# Altium schematic sheet usb.SchDoc
size A
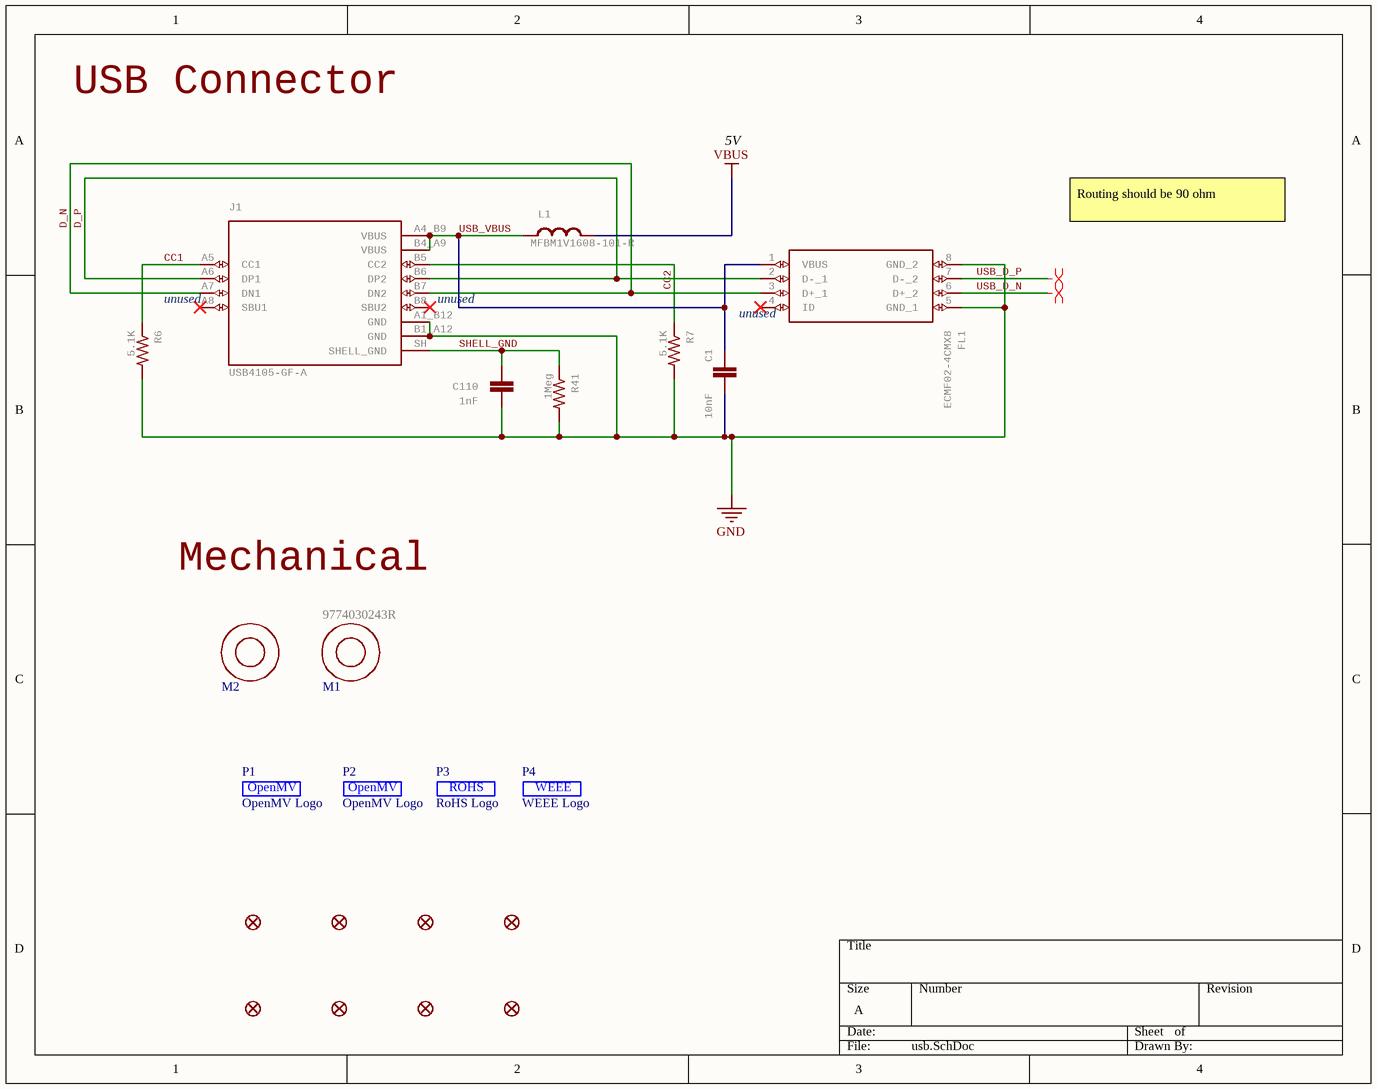
[diagram p0: usb.SchDoc]

## Parts
C1  10nF  [0402-CAP]
C110  1nF  [0402-CAP]
FD1  FIDUCIAL1X2  [FIDUCIAL-1X2]  (value not drawn)
FD2  FIDUCIAL1X2  [FIDUCIAL-1X2]  (value not drawn)
FD3  FIDUCIAL1X2  [FIDUCIAL-1X2]  (value not drawn)
FD4  FIDUCIAL1X2  [FIDUCIAL-1X2]  (value not drawn)
FD5  FIDUCIAL1X2  [FIDUCIAL-1X2]  (value not drawn)
FD6  FIDUCIAL1X2  [FIDUCIAL-1X2]  (value not drawn)
FD7  FIDUCIAL1X2  [FIDUCIAL-1X2]  (value not drawn)
FD8  FIDUCIAL1X2  [FIDUCIAL-1X2]  (value not drawn)
FL1  ECMF02-4CMX8  [ECMF024CMX8]
J1  USB4105-GF-A  [GCT_USB4105-GF-A]
L1  MFBM1V1608-101-R  [0603-RES]
M1  9774030243R  [9774030243R]
M2  9774030243R  [9774030243R]  (value not drawn)
P1  OpenMV Logo  [OMV-LOGO-SMALL]  (no BOM)
P2  OpenMV Logo  [OMV-LOGO-SMALL]  (no BOM)
P3  RoHS Logo  [ROHS]  (no BOM)
P4  WEEE Logo  [WEEE]  (no BOM)
R6  5.1K  [0402-RES]
R7  5.1K  [0402-RES]
R41  1Meg  [0402-RES]

## Nets
GND: C1.2 C110.2 FL1.5(GND_1) FL1.8(GND_2) J1.A1_B12(GND) J1.B1_A12(GND) R6.2 R7.2 R41.2
VBUS: L1.2
CC1: J1.A5(CC1) R6.1
CC2: J1.B5(CC2) R7.1
D_N: FL1.3(D+_1) J1.A7(DN1) J1.B7(DN2)
D_P: FL1.2(D-_1) J1.A6(DP1) J1.B6(DP2)
SHELL_GND: C110.1 J1.SH(SHELL_GND) R41.1
USB_D_N: FL1.6(D+_2)
USB_D_P: FL1.7(D-_2)
USB_VBUS: C1.1 FL1.1(VBUS) J1.A4_B9(VBUS) J1.B4_A9(VBUS) L1.1

Not connected (* = marked no-connect by the designer): FL1 4(ID)*; J1 A8(SBU1)* B8(SBU2)*

## Layout directives
differential pair: USB_D_N, USB_D_P

## Notes on the sheet
- USB Connector
- 5V
- Routing should be 90 ohm
- unused
- (near J1) unused
- (near FL1) unused
- Mechanical
- (in symbol OMV) OpenMV

## Library data of the parts
C1 = C-EUC0201: CAPACITOR, European symbol; MPN: 0402B103K250CT; GateName_1: G$1; SymbolName_1: C-EU; POPULARITY: 0; LibraryName: rcl; DeviceSetName: C-EU; SPICEPREFIX: C; Part Number: 0402B103K250CT
C110 = CAP0402-CAP: Capacitor; MPN: VJ0402Y102JXACW1BC; GateName_1: G$1; SymbolName_1: CAP; DeviceName: 0402-CAP; LibraryName: sfe; DeviceSetName: CAP; Part Number: VJ0402Y102JXACW1BC
FD1-FD8 = FIDUCIAL1X2: Fiducial Alignment Points    Point-of-reference for pick-and-place machines and other optical instruments.; GateName_1: G$1; DeviceName: 1X2; SymbolName_1: FIDUCIAL; LibraryName: SparkFun-Aesthetics; DeviceSetName: FIDUCIAL
FL1 = ECMF02-4CMX8: Common Mode Filter & ESD Prot. USB uQFN8 STMicroelectronics ECMF02 Series, Signal Filter uQFN SMD, Flat Contact Termination, 2.6 x 1.3 x 0.6mm   Source:  Datasheet; GateName_1: G$1; SymbolName_1: ECMF02-4CMX8; LibraryName: ECMF02-4CMX8; DeviceSetName: ECMF02-4CMX8; HEIGHT: mm; MANUFACTURER_NAME: STMicroelectronics; MANUFACTURER_PART_NUMBER: ECMF02-4CMX8; MOUSER_PART_NUMBER: 511-ECMF02-4CMX8; MOUSER_PRICE-STOCK: https://www.mouser.co.uk/ProductDetail/STMicroelectronics/ECMF02-4CMX8?qs=xYt8xtm2zhmK7GoDlDZR3A%3D%3D; MPN: ECMF02-4CMX8; Part Number: ECMF02-4CMX8
J1 = USB4105-GF-A: USB-C (USB TYPE-C) USB 2.0 Receptacle Connector 24 (16+8 Dummy) Position Surface Mount, Right Angle; Through Hole  Check availability; GateName_1: G$1; MF: GCT; SymbolName_1: USB4105-GF-A; LibraryName: USB4105-GF-A; DeviceSetName: USB4105-GF-A; AVAILABILITY: In Stock; MP: USB4105-GF-A; MPN: USB4105-GF-A; PACKAGE: None; PRICE: None; PURCHASE-URL: https://pricing.snapeda.com/search/part/USB4105-GF-A/?ref=eda; Part Number: USB4105-GF-A
L1 = INDUCTOR: InductorsBasic Inductor/Choke - 0603 and 1206. Footprints are not proven and vary greatly between part numbers.; GateName_1: G$1; MPN: MFBM1V1608-101-R; Part Number: MFBM1V1608-101-R
M1 M2 = 9774030243R: M2 3mm Standoff; GateName_1: G$1; SymbolName_1: 9774030243R; LibraryName: 9774030243R; DeviceSetName: 9774030243R; MPN: 9774030243R; Part Number: 9774030243R
P1 P2 = OMV
P3 = ROHS
P4 = WEEE
R6 R7 = RESISTOR0402-RES: ResistorBasic schematic elements and footprints for 0603, 1206, and PTH resistors.; MPN: RC0402JR-075K1L; GateName_1: G$1; SymbolName_1: RESISTOR; DeviceName: 0402-RES; LibraryName: sfe; DeviceSetName: RESISTOR; Part Number: RC0402JR-075K1L
R41 = RESISTOR0402-RES: Resistor; MPN: CRCW04021M00FKEDC; GateName_1: G$1; SymbolName_1: RESISTOR; DeviceName: 0402-RES; LibraryName: sfe; DeviceSetName: RESISTOR; Part Number: CRCW04021M00FKEDC